# EAGLE design dasblinkenhat-controller-mk-3.2 (EAGLE 7.5.0)
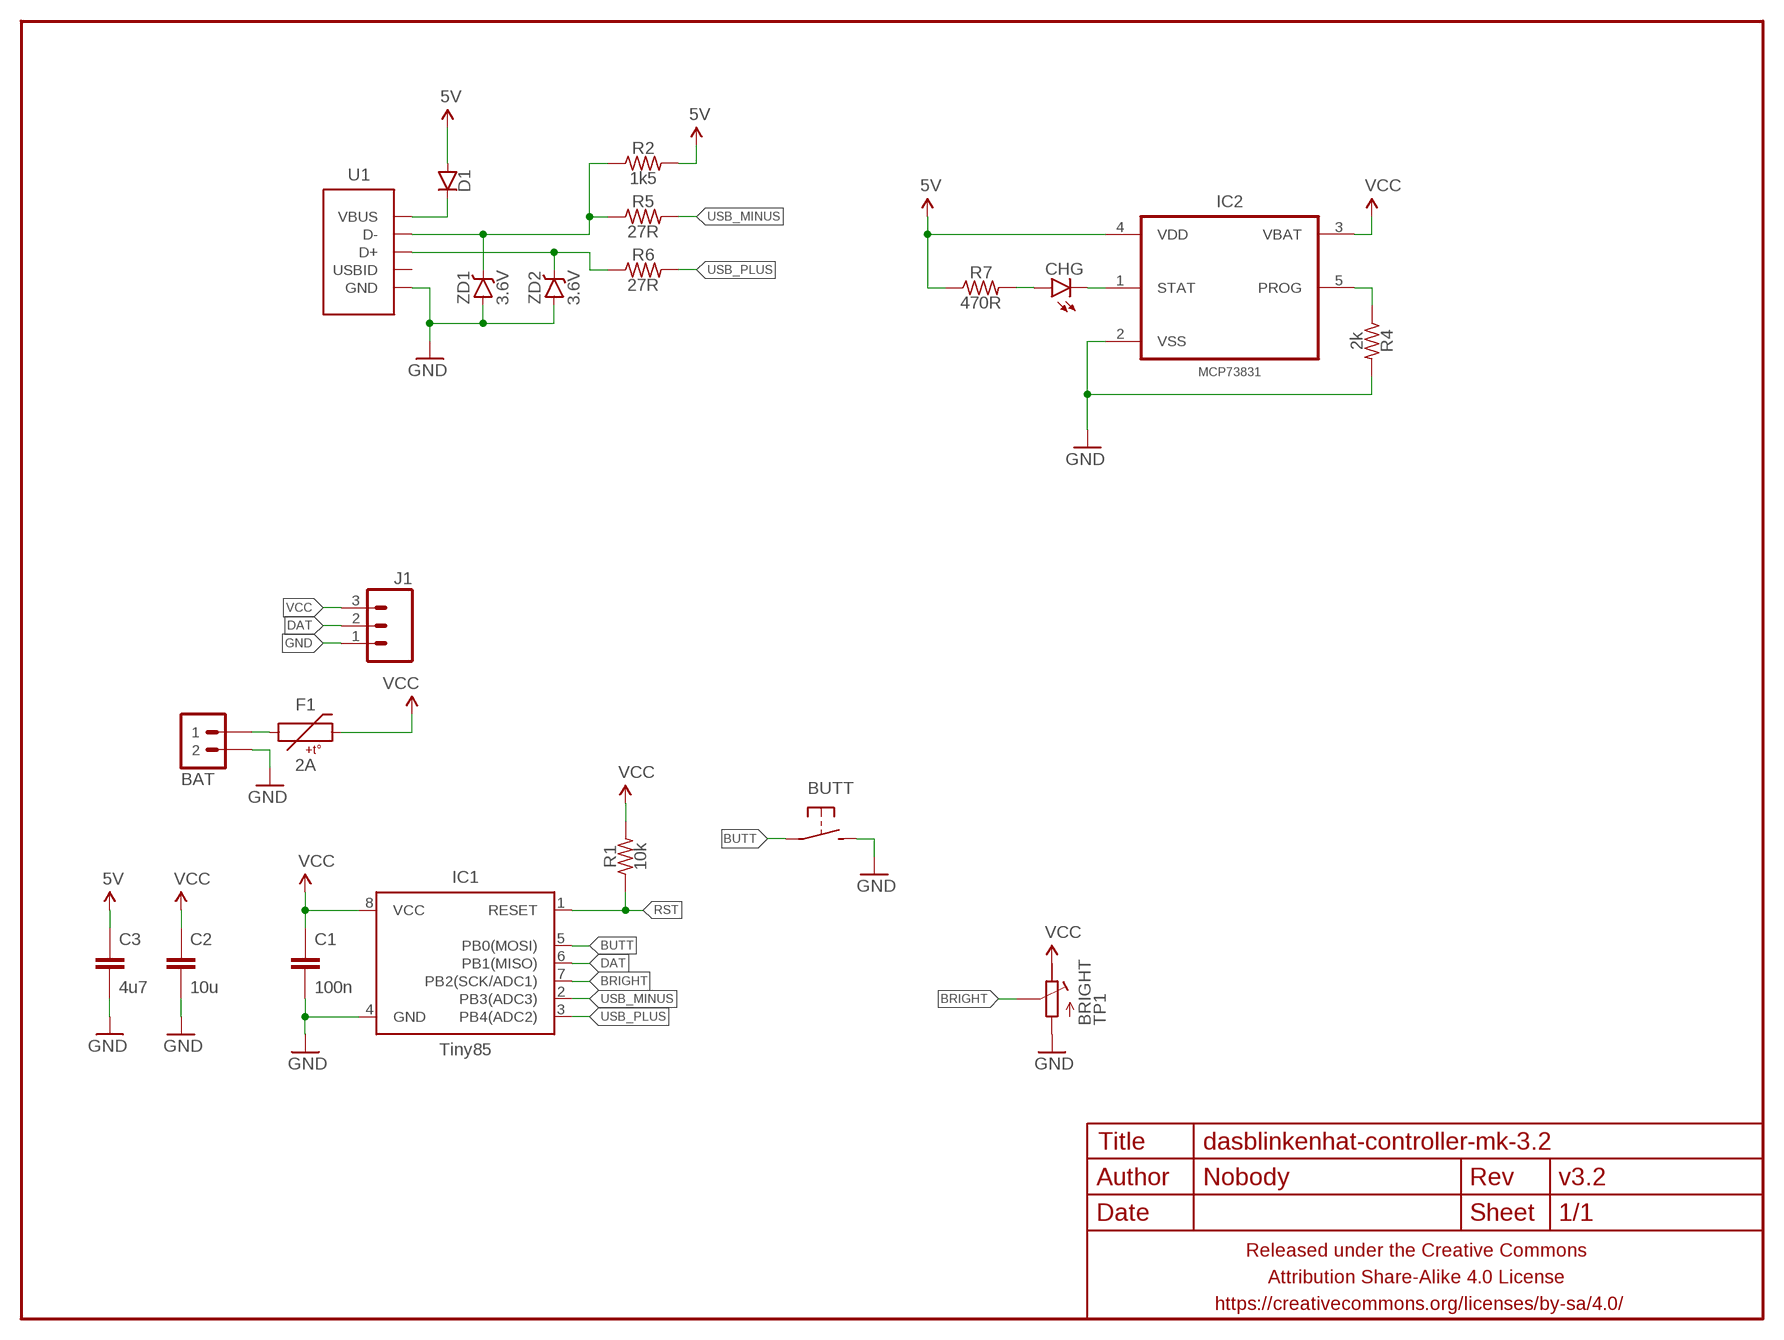
[diagram p0: schematic, sheet 1]

## Parts
BAT  M02JST-2MM-SMT  [JST-2-SMD]
BUTT  DTS-6MM  SPST-NO-TACT6MM-SMD  [DTSM-6]
C1  100n  CAPACITOR-CERAMICC0603  [C0603]
C2  10u  CAPACITOR-CERAMICC0805  [C0805]
C3  4u7  CAPACITOR-CERAMICC0805  [C0805]
CHG  LED0603  [LED-0603]
D1  DIODESOD123  [SOD123]
F1  2A  PTCSMD  [PTC-1206]
FRAME1  FRAME-LETTERNO_PACKAGE  [DUMMY]
IC1  Tiny85  ATTINY45TINY85-20-SOICW  [SO08-EIAJ]
IC2  MCP73831  MCP73831T-2ACI/OT  [SOT95P280X145-5N]
J1  M03JST-XH-RA-PTH  [JST-3-XH-RA-PTH]
R1  10k  RESISTORR0603  [R0603]
R2  1k5  RESISTORR0603  [R0603]
R4  2k  RESISTORR0603  [R0603]
R5  27R  RESISTORR0603  [R0603]
R6  27R  RESISTORR0603  [R0603]
R7  470R  RESISTORR0603  [R0603]
TP1  BRIGHT  POTENTIOMETEREVM3Y  [EVM3Y]
U1  USB-ABFCI-10103594-USB-MICRO-B-LESS  [FCI-10103594-USB-MICRO-B-LESS]
ZD1  3.6V  DIODE-ZENERSOD323  [SOD323-ZENNER]
ZD2  3.6V  DIODE-ZENERSOD323  [SOD323-ZENNER]

## Nets
5V: C3.1 D1.A IC2.4(VDD) R2.2 R7.1
BRIGHT: IC1.7(PB2(SCK/ADC1)) TP1.S
BUTT: BUTT.1 BUTT.2 IC1.5(PB0(MOSI))
DAT: IC1.6(PB1(MISO)) J1.2
GND: BAT.1 BUTT.3 BUTT.4 C1.2 C2.2 C3.2 IC1.4(GND) IC2.2(VSS) J1.1 R4.2 TP1.A U1.5(GND) ZD1.A ZD2.A
N$1: BAT.2 F1.1
N$2: D1.C U1.1(VBUS)
N$3: IC2.5(PROG) R4.1
N$4: R2.1 R5.1 U1.2(D-) ZD1.C
N$5: R6.1 U1.3(D+) ZD2.C
N$7: CHG.A R7.2
N$8: CHG.C IC2.1(STAT)
RST: IC1.1(RESET) R1.1
USB_MINUS: IC1.2(PB3(ADC3)) R5.2
USB_PLUS: IC1.3(PB4(ADC2)) R6.2
VCC: C1.1 C2.1 F1.2 IC1.8(VCC) IC2.3(VBAT) J1.3 R1.2 TP1.E
Unconnected: U1.4(USBID)

## Library data of the parts
BAT = a_parts:M02: Standard 2-pin 0.1" header. Use with - straight break away headers ( PRT-00116) - right angle break away headers (PRT-00553) - swiss pins (PRT-00743) - machine pins (PRT-00117) - female headers (PRT-00115) Molex polarized connector foot print use with: PRT-08233 with associated crimp pins and housings. 2.54_SCREWTERM for use with PRT-10571. 3.5mm Screw Terminal footprints for PRT-08084 5mm Screw Terminal footprints for use with PRT-08433; PROD_ID: CONN-08352
BUTT = A_butts:SPST-NO-TACT
C1 C2 = A_butts:CAPACITOR-CERAMIC: CAPACITOR, European symbol
C3 = a_parts:CAPACITOR-CERAMIC: CAPACITOR, European symbol
CHG = a_parts:LED: LEDs Standard schematic elements and footprints for 5mm, 3mm, 1206, and 0603 sized LEDs. 5mm - Spark Fun Electronics SKU : COM-00529 (and others)
D1 = a_parts:DIODE: Diode These are standard reverse protection diodes and small signal diodes. SMA package can handle up to about 1A. SOD-323 can handle about 200mA. What the SOD-323 package when ordering, there are some mfgs out there that are 5-pin packages.
F1 = a_parts:PTC: Resettable Fuse PTC Resettable Fuse. Spark Fun Electronics SKU : COM-08357; PROD_ID: RES-11150
FRAME1 = a_parts:FRAME-LETTER: Schematic Frame Standard 8.5x11 US Letter frame; DESIGNER: Nobody; VERSION: v3.2
IC1 = A_butts:ATTINY45: Atmel 8-pin 2/4/8kB flash uC; PROD_ID: IC-09092; VALUE: Tiny85-20-SMT
IC2 = a_parts:MCP73831T-2ACI/OT: Charge Management Controller; MPN: MCP73831T-2ACI/OT; OC_FARNELL: 1332158; OC_NEWARK: 56K7045; PACKAGE: SOT-5; SUPPLIER: Microchip
J1 = a_parts:M03: Header 3 Standard 3-pin 0.1" header. Use with straight break away headers (SKU : PRT-00116), right angle break away headers (PRT-00553), swiss pins (PRT-00743), machine pins (PRT-00117), and female headers (PRT-00115). Molex polarized connector foot print use with SKU : PRT-08232 with associated crimp pins and housings.
R1 R2 R4-R7 = A_butts:RESISTOR: RESISTOR, American symbol
TP1 = a_parts:POTENTIOMETER: Trimm resistor
U1 = a_parts:USB-AB: This is a USB AB connector that is compatible with USB OTG. i.e. this connector can serve as a host or device
ZD1 ZD2 = a_parts:DIODE-ZENER: Zener Diode Production Part - 8199 3.4V Zener Voltage

## Board
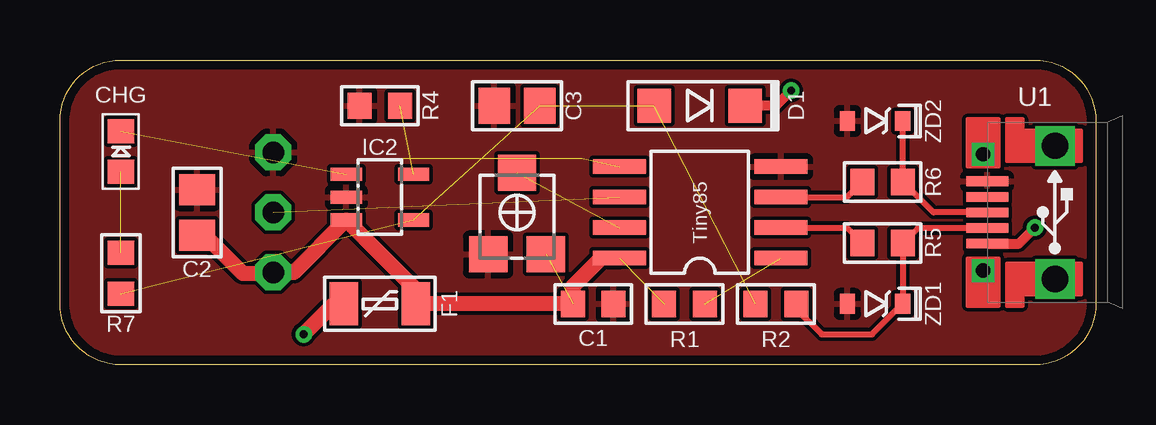
[diagram p1: board, top side]
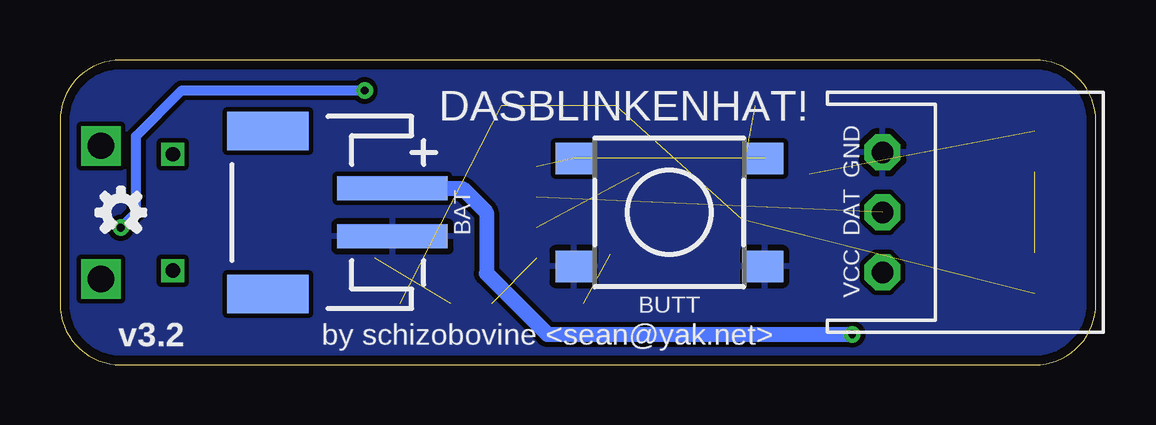
[diagram p2: board, bottom side, seen from below]

Size 43.18 x 12.7 mm. Coordinates in mm from the lower left corner, seen from the top.
Outline: 2.54,12.7 40.64,12.7 arc-90 43.18,10.16 43.18,2.54 arc-90 40.64,0 2.54,0 arc-90 0,2.54 0,10.16 arc-90 2.54,12.7
Copper layers (1*16): Top 0.0356mm / dielectric 1.5011mm / Bottom 0.0356mm
Design rules "LaenPCBOrder2": minimum track width 6mil, minimum drill 13mil, track to track 6mil, track to pad 6mil, pad to pad 6mil, via to via 6mil, smd to smd 6mil, copper to edge 15mil, drill to drill 6mil, minimum pad ring 7mil, minimum via ring 7mil, stop-mask expansion 3mil, vias tented up to drill 20mil, thermal gap 10mil

### Footprints (pad centres in the part's own frame; a part is rotated, then mirrored left to right if it is on the bottom)
JST-2-SMD = smd 1 x 4.6: 1 -1,-3.7; 2 1,-3.7 | smd 1.6 x 3.4: NC1 -3.4,1.5; NC2 3.4,1.5
DTSM-6 = smd 1.55 x 1.3: 1 -3.975,2.25; 2 3.975,2.25; 3 -3.975,-2.25; 4 3.975,-2.25
C0603 = smd 1 x 1.1: 1 -0.85,0; 2 0.85,0
C0805 = smd 1.3 x 1.5: 1 -0.95,0; 2 0.95,0
LED-0603 = smd 1.1 x 1: A 0,-0.85; C 0,0.85
SOD123 = smd 1.4 x 1.4: A 1.9,0; C -1.9,0
PTC-1206 = smd 1.2 x 1.8: 1 -1.5,0; 2 1.5,0
SO08-EIAJ = smd 0.61 x 2.21: 1 -1.905,-3.378; 2 -0.635,-3.378; 3 0.635,-3.378; 4 1.905,-3.378; 5 1.905,3.353; 6 0.635,3.353; 7 -0.635,3.353; 8 -1.905,3.353
SOT95P280X145-5N = smd 1.3 x 0.55: 1 -1.4,0.95; 2 -1.4,0; 3 -1.4,-0.95; 4 1.4,-0.95; 5 1.4,0.95
JST-3-XH-RA-PTH = drill 0.9 pad 1.5 octagon: 1 -2.5,0; 2 0,0; 3 2.5,0
R0603 = smd 1 x 1.1: 1 -0.85,0; 2 0.85,0
EVM3Y = smd 1.6 x 1.5: A -1.2,-1.75; E 1.2,-1.75; S 0,1.65
FCI-10103594-USB-MICRO-B-LESS = smd 0.4 x 1.75: 1 -1.3,2.825; 2 -0.65,2.825; 3 0,2.825; 4 0.65,2.825; 5 1.3,2.825 | drill 0.6 square: SHIELD@1 -2.425,3; SHIELD@2 2.425,3 | drill 1.1 pad 1.3 square: SHIELD@3 -2.775,0; SHIELD@4 2.775,0
SOD323-ZENNER = smd 0.63 x 0.83: A -1.15,0; C 1.15,0

### Placement (x,y rotation side)
BAT  33.02,6.35 90 bottom
BUTT  17.78,6.35 0 bottom
C1  22.23,2.54 0 top
C2  5.71,6.35 90 top
C3  19.05,10.79 180 top
CHG  2.54,8.89 0 top
D1  26.67,10.79 180 top
F1  13.34,2.54 0 top
FRAME1  0,0 0 top
IC1  26.67,6.35 90 top
IC2  13.34,6.99 0 top
J1  8.89,6.35 270 bottom
R1  26.04,2.54 180 top
R2  29.84,2.54 180 top
R4  13.34,10.79 180 top
R5  34.29,5.08 180 top
R6  34.29,7.62 180 top
R7  2.54,3.81 90 top
TP1  19.05,6.35 0 top
U1  41.48,6.35 90 top
U$2  [OSHWLOGO_TINY_SILKONLY]  40.64,6.35 0 bottom
ZD1  33.97,2.54 0 top
ZD2  33.97,10.16 0 top

### Tracks (layer width: path | path; a pad name or v marks a point on that pad's centre or on a via)
5V  (4 unrouted)
BRIGHT  (1 unrouted)
BUTT  (2 unrouted)
DAT  (1 unrouted)
GND
  pour Top: 2.54,12.7 40.64,12.7 arc-90 43.18,10.16 43.18,2.54 arc-90 40.64,0 2.54,0 arc-90 0,2.54 0,10.16 arc-90
  pour Bottom (isolate 0.2): 2.54,12.7 40.64,12.7 arc-90 43.18,10.16 43.18,2.54 arc-90 40.64,0 2.54,0 arc-90 0,2.54 0,10.16 arc-90
N$1  (via drill 0.33)
  Top 0.635: v10.16,1.27 11.43,2.54 F1.1
  Bottom 0.635: BAT.2 26.4,7.35 25.4,6.35 25.4,3.81 22.86,1.27 v10.16,1.27
N$2  (via drill 0.33)
  Top 0.406: U1.1 39.98,5.05 v40.64,5.71 | v30.48,11.43 29.84,10.79 D1.C
  Bottom 0.406: v40.64,5.71 40.01,6.35 40.01,9.53 38.1,11.43 v30.48,11.43
N$3  (1 unrouted)
N$4
  Top 0.254: U1.2 35.76,5.7 R5.1 35.14,2.56 ZD1.C 33.85,1.27 31.75,1.27 30.7,2.33 R2.1
N$5
  Top 0.254: U1.3 36.41,6.35 R6.1 35.14,10.14 ZD2.C
N$7  (1 unrouted)
N$8  (1 unrouted)
RST  (1 unrouted)
USB_MINUS
  Top 0.254: IC1.2 32.8,5.71 R5.2
USB_PLUS
  Top 0.254: IC1.3 32.8,6.99 R6.2
VCC  (2 unrouted)
  Top 0.635: C2.1 6.03,5.4 7.62,3.81 8.85,3.81 J1.3 9.75,3.85 IC2.3 | IC2.3 | IC2.3 14.84,3.13 F1.2 C1.1 21.38,3.28 22.54,4.45 IC1.8

### Text on the board
bPlace: GND | DAT | VCC